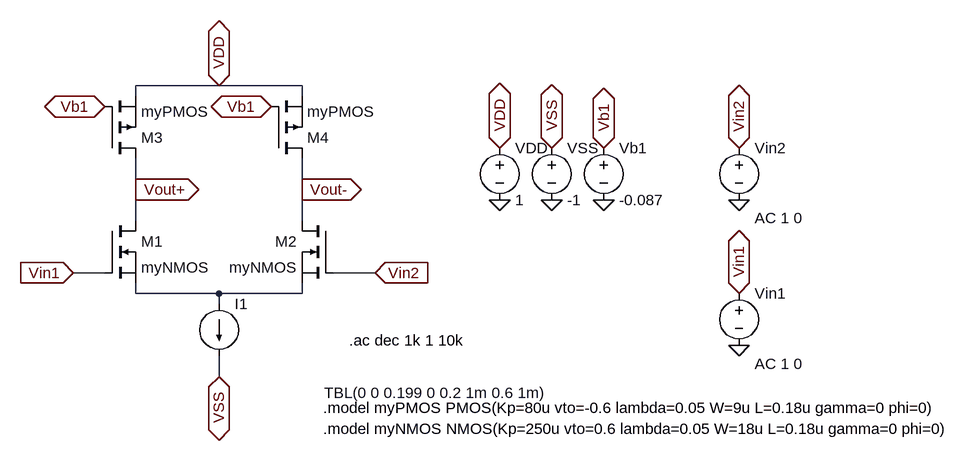
[diagram p0: schematic Project_part2.asc]
Project_part2.asc, the LTspice schematic file:
Version 4
SHEET 1 1524 680
WIRE 304 48 176 48
WIRE 432 48 304 48
WIRE 176 64 176 48
WIRE 432 64 432 48
WIRE 176 208 176 160
WIRE 432 208 432 160
WIRE 176 256 176 208
WIRE 432 256 432 208
WIRE 128 336 80 336
WIRE 544 336 480 336
WIRE 176 368 176 352
WIRE 304 368 176 368
WIRE 432 368 432 352
WIRE 432 368 304 368
WIRE 304 384 304 368
WIRE 304 496 304 464
FLAG 176 208 Vout+
IOPIN 176 208 Out
FLAG 432 208 Vout-
IOPIN 432 208 Out
FLAG 80 336 Vin1
IOPIN 80 336 In
FLAG 544 336 Vin2
IOPIN 544 336 In
FLAG 736 224 0
FLAG 816 224 0
FLAG 736 144 VDD
IOPIN 736 144 BiDir
FLAG 304 48 VDD
IOPIN 304 48 BiDir
FLAG 816 144 VSS
IOPIN 816 144 BiDir
FLAG 304 496 VSS
IOPIN 304 496 BiDir
FLAG 896 144 Vb1
IOPIN 896 144 BiDir
FLAG 128 80 Vb1
IOPIN 128 80 BiDir
FLAG 384 80 Vb1
IOPIN 384 80 BiDir
FLAG 896 224 0
FLAG 1104 448 0
FLAG 1104 368 Vin1
IOPIN 1104 368 BiDir
FLAG 1104 224 0
FLAG 1104 144 Vin2
IOPIN 1104 144 BiDir
SYMBOL pmos 384 160 M180
SYMATTR InstName M4
SYMATTR Value myPMOS
SYMBOL pmos 128 160 M180
SYMATTR InstName M3
SYMATTR Value myPMOS
SYMBOL nmos 480 256 M0
SYMATTR InstName M2
SYMATTR Value myNMOS
SYMBOL nmos 128 256 R0
SYMATTR InstName M1
SYMATTR Value myNMOS
SYMBOL voltage 896 128 R0
WINDOW 123 0 0 Left 0
WINDOW 39 0 0 Left 0
SYMATTR InstName Vb1
SYMATTR Value -0.087
SYMBOL current 304 384 R0
WINDOW 123 0 0 Left 0
WINDOW 39 0 0 Left 0
WINDOW 3 162 137 Left 2
SYMATTR Value TBL(0 0 0.199 0 0.2 1m 0.6 1m)
SYMATTR InstName I1
SYMBOL voltage 1104 352 R0
WINDOW 123 24 124 Left 2
WINDOW 39 0 0 Left 0
WINDOW 3 24 44 Left 2
SYMATTR Value2 AC 1 0
SYMATTR Value ""
SYMATTR InstName Vin1
SYMBOL voltage 1104 128 R0
WINDOW 123 24 124 Left 2
WINDOW 39 0 0 Left 0
WINDOW 3 24 44 Left 2
SYMATTR Value2 AC 1 0
SYMATTR Value ""
SYMATTR InstName Vin2
SYMBOL voltage 736 128 R0
WINDOW 123 0 0 Left 0
WINDOW 39 0 0 Left 0
SYMATTR InstName VDD
SYMATTR Value 1
SYMBOL voltage 816 128 R0
WINDOW 123 0 0 Left 0
WINDOW 39 0 0 Left 0
SYMATTR InstName VSS
SYMATTR Value -1
TEXT 464 544 Left 2 !.model myPMOS PMOS(Kp=80u vto=-0.6 lambda=0.05 W=9u L=0.18u gamma=0 phi=0)
TEXT 464 576 Left 2 !.model myNMOS NMOS(Kp=250u vto=0.6 lambda=0.05 W=18u L=0.18u gamma=0 phi=0)
TEXT 504 440 Left 2 !.ac dec 1k 1 10k

The netlist it stands for:
* Project_part2.asc
M4 Vout- Vb1 VDD VDD myPMOS
M3 Vout+ Vb1 VDD VDD myPMOS
M2 Vout- Vin2 N001 N001 myNMOS
M1 Vout+ Vin1 N001 N001 myNMOS
Vb1 Vb1 0 -0.087
I1 N001 VSS TBL(0 0 0.199 0 0.2 1m 0.6 1m)
Vin1 Vin1 0 AC 1 0
Vin2 Vin2 0 AC 1 0
VDD VDD 0 1
VSS VSS 0 -1
.model NMOS NMOS
.model PMOS PMOS
.lib standard.mos
.model myPMOS PMOS(Kp=80u vto=-0.6 lambda=0.05 W=9u L=0.18u gamma=0 phi=0)
.model myNMOS NMOS(Kp=250u vto=0.6 lambda=0.05 W=18u L=0.18u gamma=0 phi=0)
.ac dec 1k 1 10k
.backanno
.end